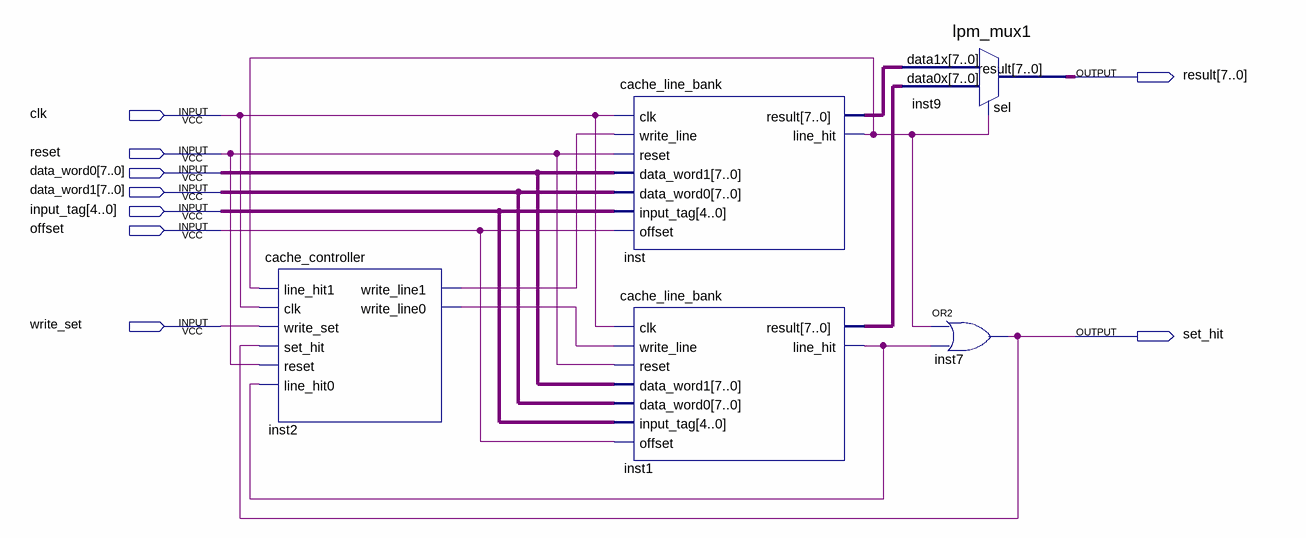
[diagram p0: schematic sheet]
// Quartus schematic cache_set_2_way.bdf as structural Verilog: 5 symbols, 9 pins
module cache_set_2_way (
  input  clk,
  input  reset,
  input  [7:0] data_word0,
  input  [7:0] data_word1,
  input  [4:0] input_tag,
  input  offset,
  input  write_set,
  output [7:0] result,
  output set_hit
);

  wire inst1_line_hit, inst2_write_line0, inst2_write_line1, inst_line_hit;
  wire [7:0] inst1_result, inst_result;

  cache_controller inst2 (
    .line_hit1(inst_line_hit), .clk(clk), .write_set(write_set), .set_hit(set_hit), .reset(reset),
    .line_hit0(inst1_line_hit), .write_line1(inst2_write_line1), .write_line0(inst2_write_line0));
  cache_line_bank inst (
    .clk(clk), .write_line(inst2_write_line1), .reset(reset), .data_word1(data_word0),
    .data_word0(data_word1), .input_tag(input_tag), .offset(offset), .result(inst_result),
    .line_hit(inst_line_hit));
  cache_line_bank inst1 (
    .clk(clk), .write_line(inst2_write_line0), .reset(reset), .data_word1(data_word0),
    .data_word0(data_word1), .input_tag(input_tag), .offset(offset), .result(inst1_result),
    .line_hit(inst1_line_hit));
  lpm_mux1 inst9 (.data1x(inst_result), .data0x(inst1_result), .sel(inst_line_hit), .result(result));
  or inst7 (set_hit, inst_line_hit, inst1_line_hit);
endmodule
